# Altium schematic sheet card_design_about.SchDoc
size A; SheetNumber: 2; SheetTotal: 2
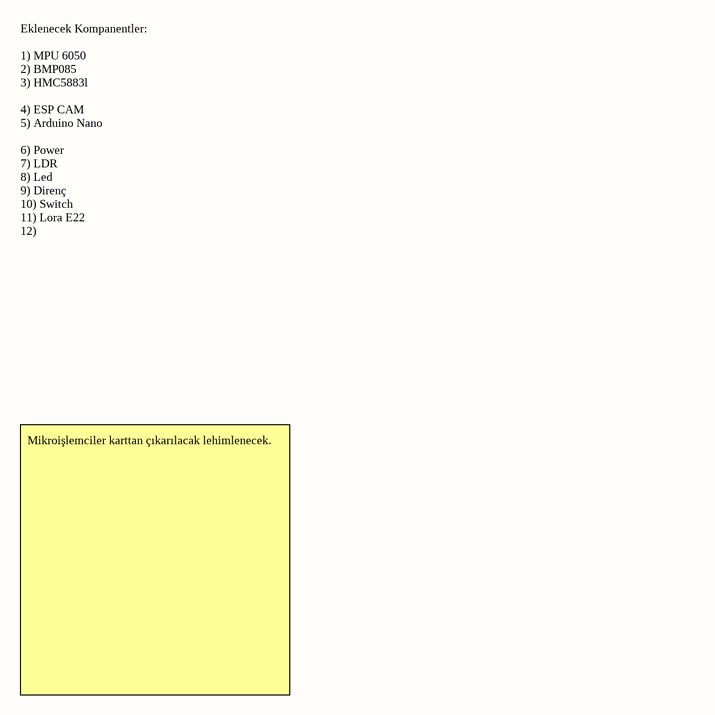
[diagram p0: card_design_about.SchDoc]

## Notes on the sheet
- Eklenecek Kompanentler:
  1) MPU 6050
  2) BMP085
  3) HMC5883l
  4) ESP CAM
  5) Arduino Nano
  6) Power
  7) LDR
  8) Led
  9) Direnç
  10) Switch
  11) Lora E22
  12)
- Mikroişlemciler karttan çıkarılacak lehimlenecek.